# EAGLE design xboard (EAGLE 6.1)
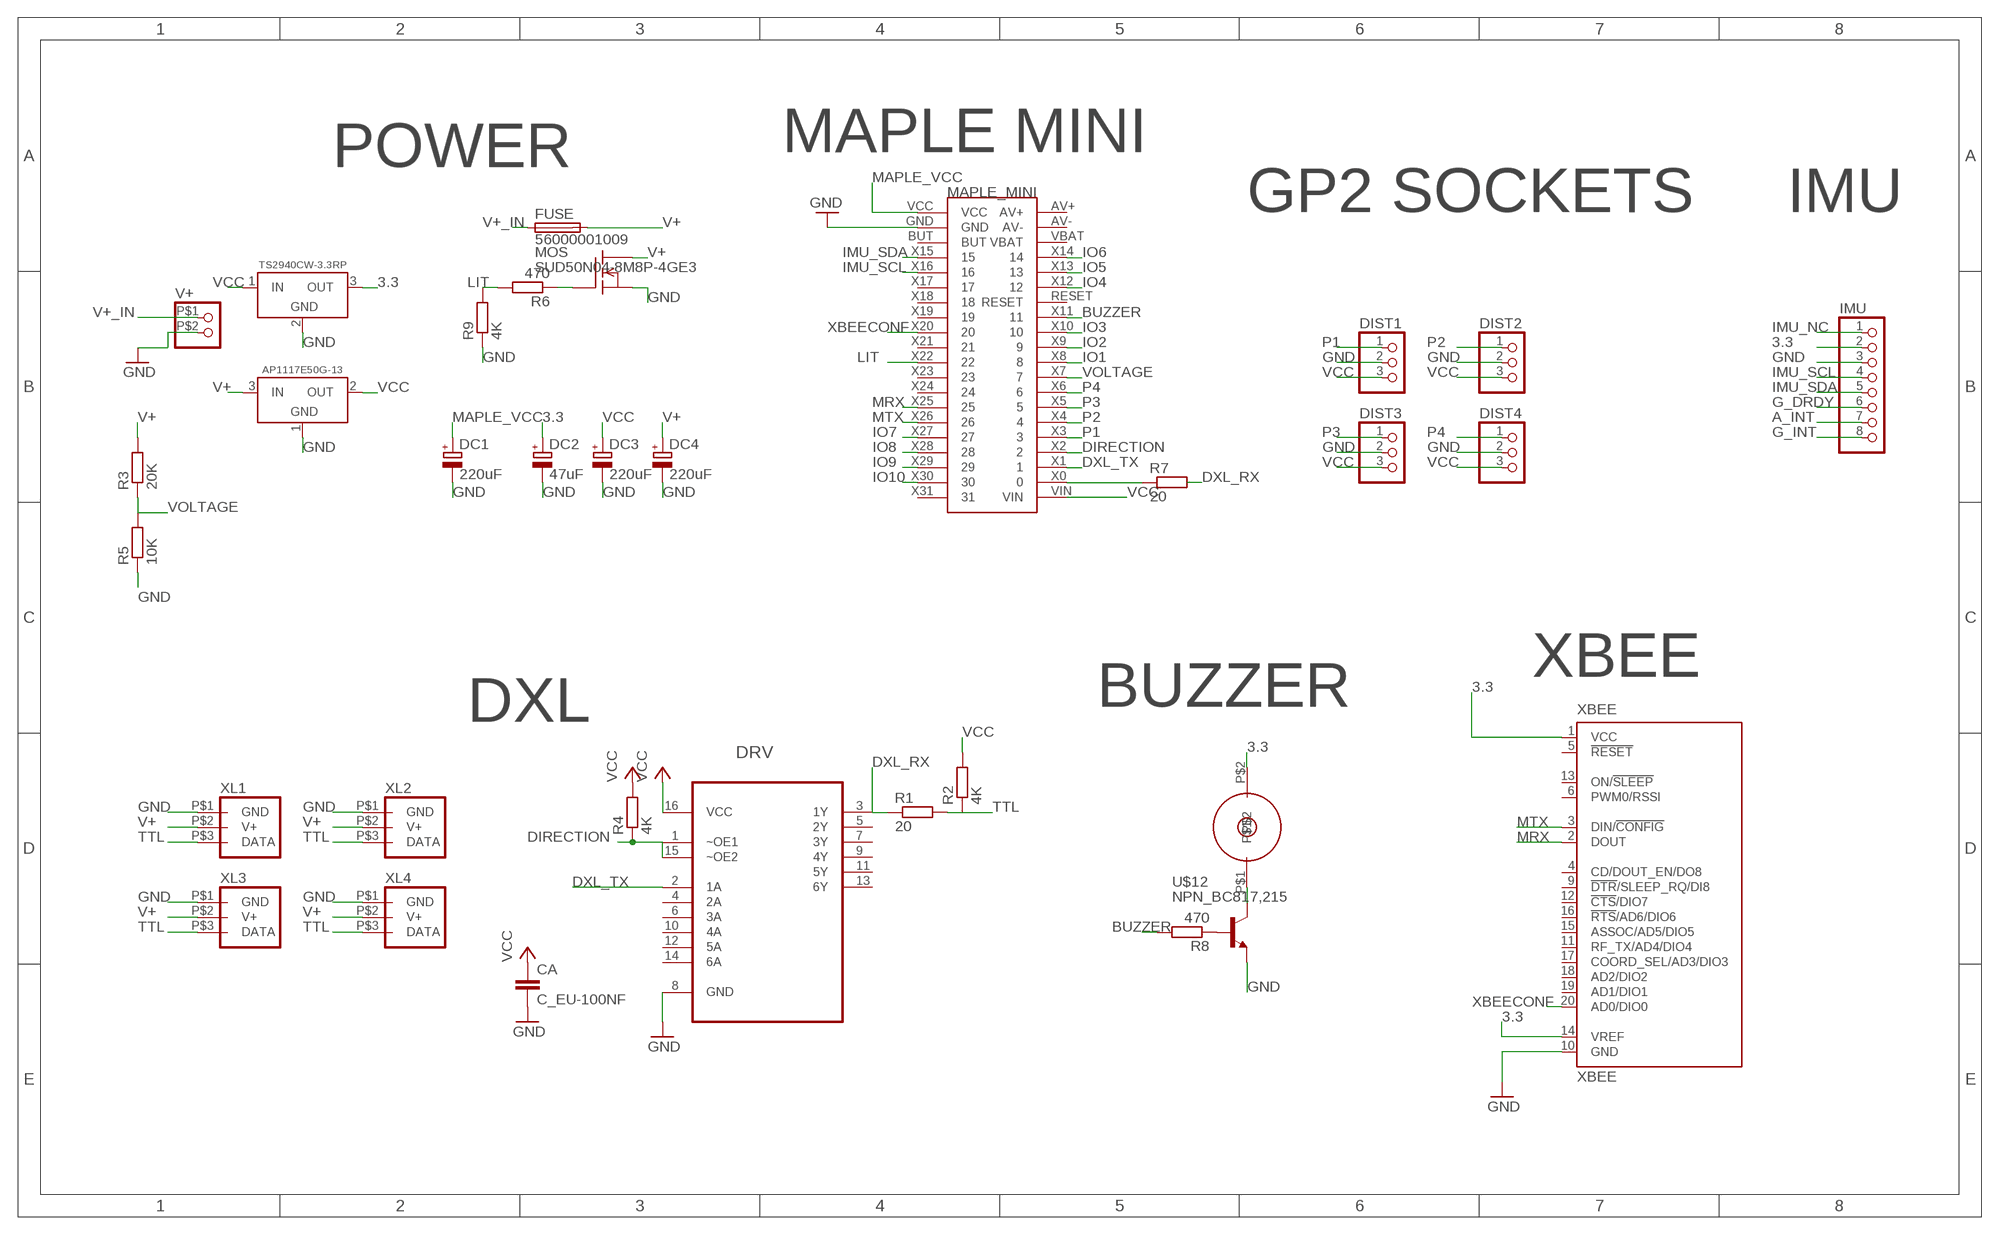
[diagram p0: schematic, sheet 1]

## Parts
BUZZER  BUZZER66  [BUZZER66]
CA  C_EU-100NF  [C0805]
DC1  220uF  CPOL_EUPANASONIC_D8  [PANASONIC_D8]
DC2  47uF  CPOL_EUPANASONIC_D  [PANASONIC_D]
DC3  220uF  CPOL_EUPANASONIC_D8  [PANASONIC_D8]
DC4  220uF  CPOL_EUPANASONIC_D8  [PANASONIC_D8]
DIST1  CONNEC_1X03  [CONNEC_1X03]
DIST2  CONNEC_1X03  [CONNEC_1X03]
DIST3  CONNEC_1X03  [CONNEC_1X03]
DIST4  CONNEC_1X03  [CONNEC_1X03]
DRV  CD74HCT367M  [SOIC127P600X175-16N]
FUSE  56000001009  [56000001009]
IMU  CONNEC_1X08  [CONNEC_1X08]
MAPLE_MINI  MAPLE_MINI  [CONNEC_2X20]
MOS  SUD50N04-8M8P-4GE3  [TO252]
R1  20  R-EU_R0805  [R0805]
R2  4K  R-EU_R0805  [R0805]
R3  20K  R-EU_R0805  [R0805]
R4  4K  RESISTANCE-R0805  [R0805]
R5  10K  R-EU_R0805  [R0805]
R6  470  R-EU_R0805  [R0805]
R7  20  R-EU_R0805  [R0805]
R8  470  R-EU_R0805  [R0805]
R9  4K  RESISTANCE-R0805  [R0805]
U$7  TS2940CW-3.3RP  [SOT223]
U$8  AP1117E50G-13  [SOT223]
U$12  NPN_BC817,215  [SOT-23]
V+  CONNEC_1X02BIG  [CONNEC_1X02_BIG]
XBEE  XBEE  [XBEE]
XL1  XL_320_CONNEC  [DXL_320_CONNEC]
XL2  XL_320_CONNEC  [DXL_320_CONNEC]
XL3  XL_320_CONNEC  [DXL_320_CONNEC]
XL4  XL_320_CONNEC  [DXL_320_CONNEC]

## Nets
3.3: BUZZER.P$2 DC2.+ IMU.2 U$7.3(OUT) XBEE.1(VCC) XBEE.14(VREF)
A_INT: IMU.7
BUZZER: MAPLE_MINI.X11 R8.2
DIRECTION: DRV.1(~OE1) DRV.15(~OE2) MAPLE_MINI.X2 R4.1
DXL_RX: DRV.3(1Y) R1.1 R7.2
DXL_TX: DRV.2(1A) MAPLE_MINI.X1
G_DRDY: IMU.6
G_INT: IMU.8
GND [alime]: CA.2 DC1.- DC2.- DC3.- DC4.- DIST1.2 DIST2.2 DIST3.2 DIST4.2 DRV.8(GND) IMU.3 MAPLE_MINI.GND MOS.2(S) R5.1 R9.1 U$7.2(GND) U$8.1(GND) U$12.2(E) V+.P$2 XBEE.10(GND) XL1.P$1(GND) XL2.P$1(GND) XL3.P$1(GND) XL4.P$1(GND)
IMU_NC: IMU.1
IMU_SCL: IMU.4 MAPLE_MINI.X16
IMU_SDA: IMU.5 MAPLE_MINI.X15
IO1: MAPLE_MINI.X8
IO2: MAPLE_MINI.X9
IO3: MAPLE_MINI.X10
IO4: MAPLE_MINI.X12
IO5: MAPLE_MINI.X13
IO6: MAPLE_MINI.X14
IO7: MAPLE_MINI.X27
IO8: MAPLE_MINI.X28
IO9: MAPLE_MINI.X29
IO10: MAPLE_MINI.X30
LIT: MAPLE_MINI.X22 R6.2 R9.2
MAPLE_VCC: DC1.+ MAPLE_MINI.VCC
MRX: MAPLE_MINI.X25 XBEE.2(DOUT)
MTX: MAPLE_MINI.X26 XBEE.3(DIN/!CONFIG)
N$1: MOS.1(G) R6.1
N$2: MAPLE_MINI.X0 R7.1
N$3: R8.1 U$12.1(B)
N$5: BUZZER.P$1 U$12.3(C)
P1: DIST1.1 MAPLE_MINI.X3
P2: DIST2.1 MAPLE_MINI.X4
P3: DIST3.1 MAPLE_MINI.X5
P4: DIST4.1 MAPLE_MINI.X6
TTL: R1.2 R2.1 XL1.P$3(DATA) XL2.P$3(DATA) XL3.P$3(DATA) XL4.P$3(DATA)
V+ [alime]: DC4.+ FUSE.P$2 MOS.3(D) R3.2 U$8.3(IN) XL1.P$2(V+) XL2.P$2(V+) XL3.P$2(V+) XL4.P$2(V+)
V+_IN [alime]: FUSE.P$1 V+.P$1
VCC: CA.1 DC3.+ DIST1.3 DIST2.3 DIST3.3 DIST4.3 DRV.16(VCC) MAPLE_MINI.VIN R2.2 R4.2 U$7.1(IN) U$8.2(OUT)
VOLTAGE: MAPLE_MINI.X7 R3.1 R5.2
XBEECONF: MAPLE_MINI.X20 XBEE.20(AD0/DIO0)
Unconnected: DRV.4(2A) DRV.5(2Y) DRV.6(3A) DRV.7(3Y) DRV.9(4Y) DRV.10(4A) DRV.11(5Y) DRV.12(5A) DRV.13(6Y) DRV.14(6A) MAPLE_MINI.AV+ MAPLE_MINI.AV- MAPLE_MINI.BUT MAPLE_MINI.RESET MAPLE_MINI.VBAT MAPLE_MINI.X17 MAPLE_MINI.X18 MAPLE_MINI.X19 MAPLE_MINI.X21 MAPLE_MINI.X23 MAPLE_MINI.X24 MAPLE_MINI.X31 XBEE.4(CD/DOUT_EN/DO8) XBEE.5(!RESET) XBEE.6(PWM0/RSSI) XBEE.9(!DTR!/SLEEP_RQ/DI8) XBEE.11(RF_TX/AD4/DIO4) XBEE.12(!CTS!/DIO7) XBEE.13(ON/!SLEEP) XBEE.15(ASSOC/AD5/DIO5) XBEE.16(!RTS!/AD6/DIO6) XBEE.17(COORD_SEL/AD3/DIO3) XBEE.18(AD2/DIO2) XBEE.19(AD1/DIO1)

## Notes on the sheet
- POWER | MAPLE MINI
- GP2 SOCKETS | IMU
- XBEE
- DXL | BUZZER

## Library data of the parts
BUZZER = rhoban:BUZZER
CA = rhoban:C_EU: non polarised condo; DATASHEET: condo100nF.pdf; FARNELL_LINK: http://fr.farnell.com/kemet/c0805c104j5ractu/condensateur-100nf-50v-x7r-0805/dp/1414663RL
DC1-DC4 = rhoban:CPOL_EU: 680 uF 16 V : http://fr.farnell.com/panasonic/eeufr1c681l/condensateur-radial-16v-680uf/dp/1800635 680 uF 25 V : http://fr.farnell.com/panasonic/eeufr1e681l/capacitor-radial-25v-680uf-20/dp/2063069 330 uF 25 V : http://fr.farnell.com/panasonic/eeufr1e331/condensateur-radial-25v-330uf/dp/1800648?Ntt=eeufr1e331
DIST1-DIST4 = rhoban:CONNEC_1X03
DRV = rhoban:CD74HCT367M: High-Speed CMOS Logic Hex Buffer/Line Driver,; MPN: CD74HCT367M; OC_FARNELL: 1739593; OC_NEWARK: 50R5270; PACKAGE: SOIC-16; SUPPLIER: Texas Instruments
FUSE = rhoban:56000001009
IMU = rhoban:CONNEC_1X08
MAPLE_MINI = rhoban:MAPLE_MINI
MOS = rhoban:SUD50N04-8M8P-4GE3
R1-R3 R5-R8 = rcl:R-EU_: RESISTOR, European symbol
R4 R9 = rhoban:RESISTANCE: RESISTOR, European symbol
U$7 = rhoban:TS2940CW-3.3RP
U$8 = rhoban:AP1117E50G-13
U$12 = rhoban:NPN
V+ = RobotCampus:CONNEC_1X02
XBEE = RobotCampus:XBEE: XBee (TM) /XBee-PRO(TM) OEM RF Modules Source: MaxStream, Inc. xbee_productmanual.pdf; MPN: XBP24-Z7UIT-004; OC_FARNELL: 1751799; OC_NEWARK: 34R5507
XL1-XL4 = RobotCampus:XL_320_CONNEC

## Net classes
0 default: width 0.254 mm
1 alime: width 0.889 mm, drill 0.33 mm

## Board
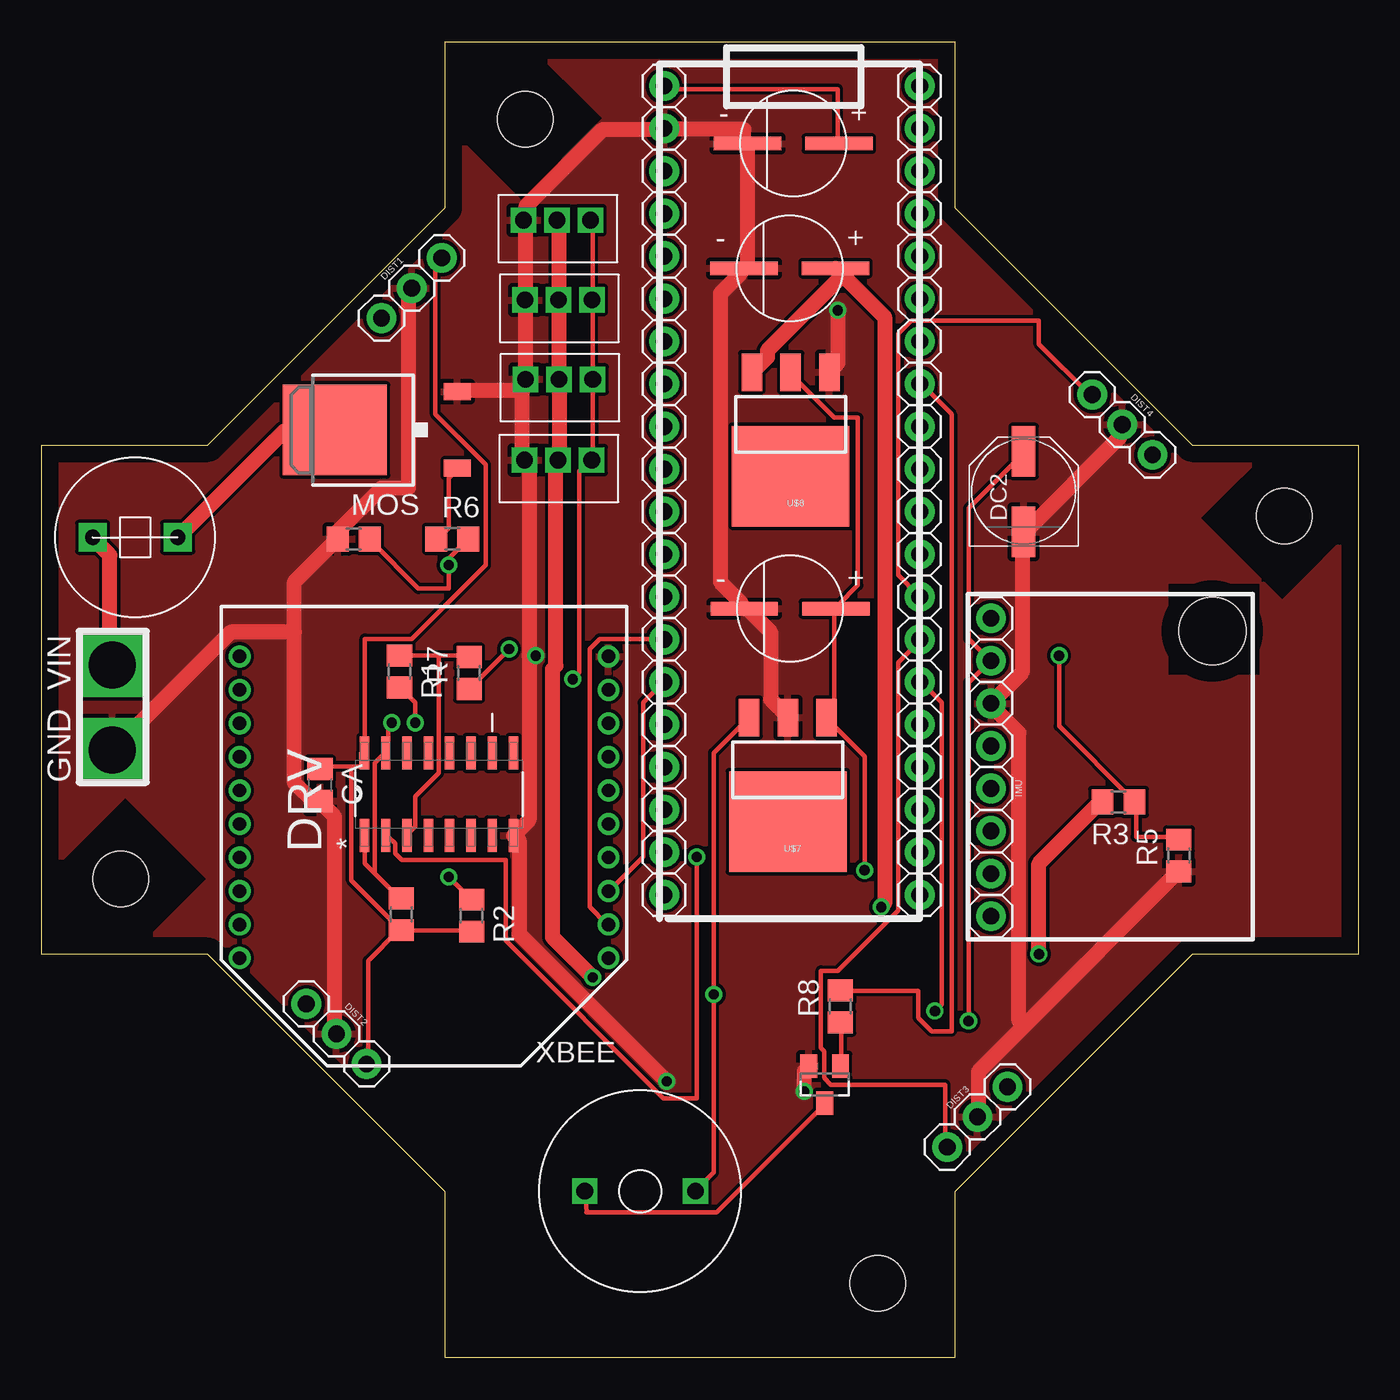
[diagram p1: board, top side]
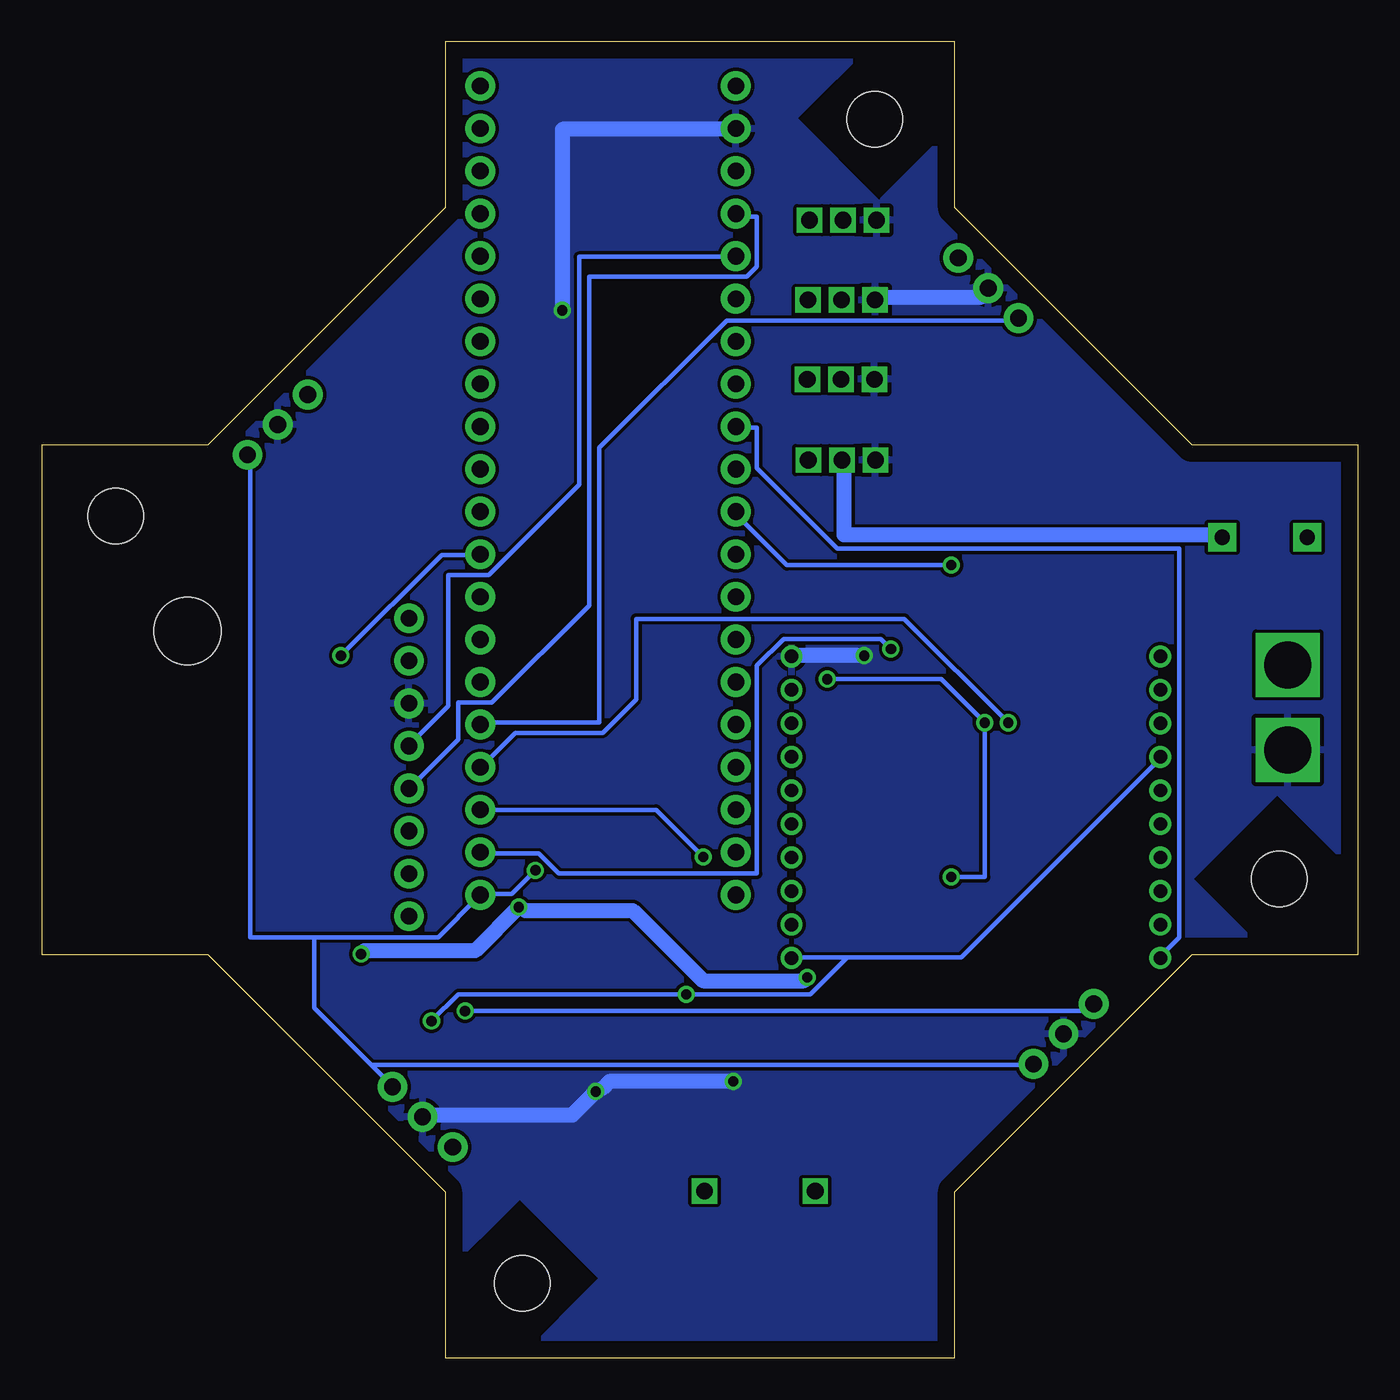
[diagram p2: board, bottom side, seen from below]

Size 78.49 x 78.49 mm. Coordinates in mm from the lower left corner, seen from the top.
Outline: 24.04,68.59 24.04,78.49 54.45,78.49 54.45,68.59 68.59,54.45 78.49,54.45 78.49,24.04 68.59,24.04 54.45,9.9 54.45,0 24.04,0 24.04,9.9 9.9,24.04 0,24.04 0,54.45 9.9,54.45 24.04,68.59
Copper layers (1*16): Top 0.035mm / dielectric 1.5mm / Bottom 0.035mm
Design rules: minimum track width 10mil, minimum drill 24mil, track to track 8mil, track to pad 8mil, pad to pad 8mil, via to via 8mil, smd to smd 8mil, copper to edge 40mil, drill to drill 8mil, minimum pad ring 10mil, minimum via ring 8mil, stop-mask expansion 4mil, vias tented up to drill 0mil, thermal gap 10mil
Holes 4 mm at 69.8,43.35
tRestrict: area 45.3,0.1 to 54.7,9.4; area 0,23.6 to 9.8,33.4; area 69.1,45.3 to 78.8,54.9; area 23.9,69.1 to 33.4,78.6; area 67.2,40.8 to 72.6,46.2
bRestrict: area 45.3,0.1 to 54.7,9.4; area -0.1,23.6 to 9.8,33.5; area 69,45.1 to 79,55.2; area 23.9,69.1 to 33.4,78.6; area 67.2,40.8 to 72.6,46.2
Milling: 16 lines

### Footprints (pad centres in the part's own frame; a part is rotated, then mirrored left to right if it is on the bottom)
BUZZER66 = drill 1 square: P$1 -3.3,0; P$2 3.3,0
C0805 = smd 1.3 x 1.5: 1 -0.95,0; 2 0.95,0
PANASONIC_D8 = smd 4.016 x 0.8: + 2.73,0; - -2.73,0
PANASONIC_D = smd 3 x 1.4: + 2.4,0; - -2.4,0
CONNEC_1X03 = drill 1 pad 1.778: 1 -1.27,1.27; 2 1.27,1.27; 3 3.81,1.27
SOIC127P600X175-16N = smd 1.981 x 0.559: 1 -2.464,4.445; 2 -2.464,3.175; 3 -2.464,1.905; 4 -2.464,0.635; 5 -2.464,-0.635; 6 -2.464,-1.905; 7 -2.464,-3.175; 8 -2.464,-4.445; 9 2.464,-4.445; 10 2.464,-3.175; 11 2.464,-1.905; 12 2.464,-0.635; 13 2.464,0.635; 14 2.464,1.905; 15 2.464,3.175; 16 2.464,4.445
56000001009 = drill 0.9 pad 1.676 square: P$1 -2.54,0; P$2 2.54,0
CONNEC_1X08 = drill 1 pad 1.778: 1 -10.16,0; 2 -7.62,0; 3 -5.08,0; 4 -2.54,0; 5 0,0; 6 2.54,0; 7 5.08,0; 8 7.62,0
CONNEC_2X20 = drill 1 pad 1.778: AV+ 0,0; AV- 2.54,0; BUT 5.08,-15.24; GND 2.54,-15.24; RESET 15.24,0; VBAT 5.08,0; VCC 0,-15.24; VIN 48.26,0; X0 45.72,0; X1 43.18,0; X2 40.64,0; X3 38.1,0; X4 35.56,0; X5 33.02,0; X6 30.48,0; X7 27.94,0; X8 25.4,0; X9 22.86,0; X10 20.32,0; X11 17.78,0; X12 12.7,0; X13 10.16,0; X14 7.62,0; X15 7.62,-15.24; X16 10.16,-15.24; X17 12.7,-15.24; X18 15.24,-15.24; X19 17.78,-15.24; X20 20.32,-15.24; X21 22.86,-15.24; X22 25.4,-15.24; X23 27.94,-15.24; X24 30.48,-15.24; X25 33.02,-15.24; X26 35.56,-15.24; X27 38.1,-15.24; X28 40.64,-15.24; X29 43.18,-15.24; X30 45.72,-15.24; X31 48.26,-15.24
TO252 = smd 1 x 1.6: 1 -2.28,-4.8; 2 2.28,-4.8 | smd 5.4 x 6.2: 3 0,2.5
R0805 = smd 1.3 x 1.5: 1 -0.95,0; 2 0.95,0
STAND-OFF = hole 3.302: 0,0
SOT223 = smd 1.219 x 2.235: 1 -2.311,-3.099; 2 0,-3.099; 3 2.311,-3.099 | smd 7 x 6: 4 0,3.099
SOT-23 = smd 1 x 1.4: 1 -0.95,-1.1; 2 0.95,-1.1; 3 0,1.1
CONNEC_1X02_BIG = drill 2.8 square: P$1 0,0; P$2 5.08,0
XBEE = drill 0.8 pad 1.27: 1 -11,9; 2 -11,7; 3 -11,5; 4 -11,3; 5 -11,1; 6 -11,-1; 7 -11,-3; 8 -11,-5; 9 -11,-7; 10 -11,-9; 11 11,-9; 12 11,-7; 13 11,-5; 14 11,-3; 15 11,-1; 16 11,1; 17 11,3; 18 11,5; 19 11,7; 20 11,9
DXL_320_CONNEC = drill 1 square: P$1 -10,2.5; P$2 -8,2.5; P$3 -6,2.5

### Placement (x,y rotation side)
BUZZER  35.67,9.93 0 top
CA  16.58,34.16 270 top
DC1  44.8,72.43 0 top
DC2  58.54,51.66 90 top
DC3  44.62,44.68 0 top
DC4  44.6,64.98 0 top
DIST1  22.05,62.01 45 top
DIST2  15.77,19.31 315 top
DIST3  55.79,12.56 45 top
DIST4  62.63,55.65 315 top
DRV  23.68,33.61 90 top
FUSE  5.56,48.93 0 top
IMU  56.6,33.95 270 top
MAPLE_MINI  52.34,75.86 270 top
MOS  19.97,55.34 90 top
R1  21.33,40.92 270 top
R2  25.63,26.36 270 top
R3  64.2,33.15 180 top
R4  21.43,26.44 270 top
R5  67.8,29.95 90 top
R6  24.47,48.84 0 top
R7  25.47,40.84 90 top
R8  47.61,20.95 90 top
R9  18.6,48.83 0 top
U$1  [STAND-OFF]  4.69,28.55 45 top
U$2  [STAND-OFF]  49.86,4.44 45 top
U$3  [STAND-OFF]  74.1,50.21 45 top
U$4  [STAND-OFF]  28.81,73.88 45 top
U$7  44.48,35.07 180 top
U$8  44.65,55.68 180 top
U$12  46.68,16.29 180 top
V+  4.18,41.33 270 top
XBEE  22.79,32.83 180 top
XL1  38.84,55.86 0 top
XL2  38.71,65.36 0 top
XL3  38.8,60.59 0 top
XL4  38.78,51.04 0 top

### Tracks (layer width: path | path; a pad name or v marks a point on that pad's centre or on a via)
3.3  (via drill 0.61)
  Top 0.254: U$7.3 42.06,38.07 40.06,36.07 v40.06,21.67 40.06,11.07 40.06,11.05 BUZZER.P$2 | DC2.+ 58.46,53.87 55.26,50.67 55.26,42.87 56.46,41.67 IMU.2 56.46,41.47 55.26,40.27 v55.26,20.07
  Bottom 0.254: 30.46,23.87 33.66,23.87 XBEE.1 | 30.46,23.87 23.66,23.87 11.86,35.67 XBEE.14 | v55.26,20.07 53.66,21.67 v40.06,21.67 32.66,21.67 30.46,23.87
BUZZER
  Top 0.254: R8.2 47.66,21.87 52.26,21.87 52.26,20.27 53.06,19.47 54.26,19.47 54.26,56.27 52.46,58.07 MAPLE_MINI.X11
DIRECTION  (via drill 0.61)
  Top 0.254: 19.86,28.87 19.26,29.47 19.26,31.07 DRV.1 | 19.86,28.87 21.26,27.47 R4.1 | 19.86,28.87 19.86,35.47 20.46,36.07 DRV.15 20.66,36.27 20.66,37.67 v20.86,37.87
  Bottom 0.254: v20.86,37.87 27.06,44.07 43.06,44.07 43.06,39.27 45.06,37.27 50.26,37.27 52.26,35.27 MAPLE_MINI.X2
DXL_RX
  Top 0.254: 23.66,41.87 21.46,41.87 R1.1 | 23.66,41.87 25.46,41.87 R7.2 | 23.66,41.87 23.66,34.87 22.26,33.47 22.26,31.67 21.86,31.27 DRV.3
DXL_TX  (via drill 0.61)
  Top 0.254: v39.06,29.87 39.06,15.47 37.06,15.47 27.66,24.87 27.66,29.67 21.46,29.67 21.06,30.07 21.06,30.67 20.66,31.07 DRV.2
  Bottom 0.254: v39.06,29.87 41.86,32.67 52.26,32.67 MAPLE_MINI.X1
GND  (via drill 0.61)
  Top 0.889: DIST4.2 64.26,55.47 64.26,54.87 58.66,49.27 DC2.- 58.46,48.87 58.46,40.87 56.66,39.07 IMU.3 56.86,38.67 58.26,37.27 58.26,20.07 58.56,19.77 | v45.46,15.87 45.46,17.07 45.66,17.27 U$12.2 | 58.56,19.77 55.86,17.07 55.86,14.47 DIST3.2 | 58.56,19.77 67.66,28.87 R5.1 | DIST2.2 17.46,19.47 17.46,32.27 16.66,33.07 CA.2 16.26,33.07 15.06,34.27 15.06,43.27 | 15.06,43.27 15.06,46.27 17.46,48.67 R9.1 17.66,49.27 20.26,51.87 21.86,51.87 21.86,63.67 DIST1.2 | 15.06,43.27 11.26,43.27 4.26,36.27 V+.P$2 | v47.46,62.47 47.46,59.27 47.06,58.87 U$8.1 | U$7.2 44.46,38.27 43.46,39.27 43.46,43.27 42.06,44.67 DC3.- 41.66,45.07 40.46,46.27 40.46,63.47 41.66,64.67 DC4.- 42.06,65.07 42.06,72.27 DC1.- 41.86,72.67 41.86,73.27 37.26,73.27 MAPLE_MINI.GND 36.66,73.27 33.46,73.27 28.86,68.67 28.86,68.27 XL2.P$1 28.86,67.67 28.86,63.47 XL3.P$1 28.86,63.07 28.86,58.67 XL1.P$1 28.66,58.27 28.66,57.67 | 28.66,57.67 24.86,57.67 MOS.2 | 28.26,31.27 29.06,32.07 29.06,41.87 | 29.06,41.87 29.06,53.27 28.86,53.47 XL4.P$1 28.66,53.87 28.66,57.67 | 28.26,31.27 DRV.8 | v29.46,41.87 29.06,41.87 | v37.26,16.47 28.46,25.27 28.46,30.87 28.26,31.27
  Bottom 0.889: DIST3.2 55.66,14.47 46.86,14.47 v45.46,15.87 45.06,16.07 44.66,16.47 v37.26,16.47 | v47.46,62.47 47.46,73.27 37.26,73.27 MAPLE_MINI.GND | DIST1.2 22.06,63.67 22.46,63.27 28.66,63.27 XL3.P$1 | v29.46,41.87 33.66,41.87 XBEE.10
  pour Top: 2.62,95.61 95.15,95.61 95.15,-14.02 -10.08,-14.02 -10.08,53.77
  pour Bottom: -10.8,85.99 88.2,85.99 88.2,-4.4 -24.23,-4.4 -24.23,53.05
IMU_SCL
  Bottom 0.254: IMU.4 56.46,36.67 54.26,38.87 54.26,46.67 51.86,46.67 46.46,52.07 46.46,65.67 37.26,65.67 MAPLE_MINI.X16
IMU_SDA
  Bottom 0.254: IMU.5 56.46,34.07 53.66,36.87 53.66,39.07 51.66,39.07 45.86,44.87 45.86,64.47 36.46,64.47 35.86,65.07 35.86,68.07 37.06,68.07 MAPLE_MINI.X15
LIT  (via drill 0.61)
  Top 0.254: R9.2 19.66,48.67 22.46,45.87 24.26,45.87 v24.26,47.27 24.26,47.67 25.26,48.67 R6.2
  Bottom 0.254: v24.26,47.27 34.06,47.27 37.06,50.27 MAPLE_MINI.X22
MAPLE_VCC
  Top 0.254: MAPLE_MINI.VCC 37.26,75.67 47.46,75.67 47.46,72.47 DC1.+
MRX
  Top 0.254: XBEE.2 33.66,25.87 32.66,26.87 32.66,42.27 33.26,42.87 37.06,42.87 MAPLE_MINI.X25
MTX
  Top 0.254: XBEE.3 33.86,27.87 35.86,29.87 35.86,39.07 37.06,40.27 MAPLE_MINI.X26
N$1
  Top 0.254: R6.1 23.66,48.87 24.26,49.47 24.26,52.47 24.66,52.87 MOS.1
N$2  (via drill 0.61)
  Top 0.254: v27.86,42.27 25.66,40.07 R7.1
  Bottom 0.254: v27.86,42.27 28.46,42.87 34.26,42.87 35.86,41.27 35.86,28.87 47.66,28.87 48.86,30.07 52.26,30.07 MAPLE_MINI.X0
N$3
  Top 0.254: U$12.1 47.66,17.47 47.66,19.87 R8.1
N$5
  Top 0.254: U$12.3 46.66,15.07 40.26,8.67 32.46,8.67 32.49,8.68 BUZZER.P$1
P1
  Bottom 0.254: DIST1.1 20.26,61.87 37.66,61.87 45.26,54.27 45.26,37.87 52.26,37.87 MAPLE_MINI.X3
P2  (via drill 0.61)
  Top 0.254: v53.26,20.67 53.66,21.07 53.66,39.07 52.46,40.27 MAPLE_MINI.X4
  Bottom 0.254: v53.26,20.67 16.26,20.67 15.86,21.07 DIST2.1
P3
  Top 0.254: MAPLE_MINI.X5 52.26,42.67 51.06,41.47 51.06,26.67 47.46,23.07 46.46,23.07 46.46,18.47 46.66,18.27 46.66,16.67 47.06,16.27 53.86,16.27 53.86,12.67 DIST3.1
P4
  Top 0.254: MAPLE_MINI.X6 52.26,45.47 51.06,46.67 51.06,61.07 51.86,61.87 59.46,61.87 59.46,60.47 62.46,57.47 DIST4.1
TTL  (via drill 0.61)
  Top 0.254: v22.26,37.87 22.26,39.07 21.46,39.87 R1.2 | v24.26,28.67 25.46,27.47 R2.1 | XL2.P$3 32.86,67.67 32.86,63.27 XL3.P$3 32.86,63.07 32.86,58.47 XL1.P$3 32.86,58.27 32.86,53.67 XL4.P$3 32.66,53.47 32.06,52.87 32.06,40.87 v31.66,40.47
  Bottom 0.254: v24.26,28.67 22.26,28.67 v22.26,37.87 24.86,40.47 v31.66,40.47
V+  (via drill 0.61)
  Top 0.889: XL2.P$2 30.86,67.67 30.86,63.47 XL3.P$2 30.86,63.07 30.86,58.67 XL1.P$2 30.86,58.27 30.86,53.67 XL4.P$2 30.66,53.27 30.66,41.27 30.46,41.07 30.46,25.07 v32.86,22.67 | FUSE.P$2 8.26,49.07 14.46,55.27 17.46,55.27 MOS.3 | v59.46,24.07 59.46,29.47 63.06,33.07 R3.2 | v50.06,26.87 50.26,27.07 50.26,62.07 47.76,64.57 | 47.76,64.57 47.46,64.87 DC4.+ | 47.76,64.57 43.26,60.07 43.26,59.67 42.46,58.87 U$8.3
  Bottom 0.889: XL4.P$2 30.66,53.47 30.66,49.07 8.26,49.07 FUSE.P$2 | v59.46,24.07 59.26,24.27 52.66,24.27 v50.06,26.87 49.66,26.67 43.26,26.67 39.06,22.47 33.06,22.47 v32.86,22.67
V+_IN
  Top 0.889: FUSE.P$1 3.06,48.87 4.06,47.87 4.06,41.47 V+.P$1
VCC  (via drill 0.61)
  Top 0.254: 18.46,35.27 19.06,35.27 19.06,36.07 DRV.16 19.26,36.27 19.26,42.87 22.06,42.87 26.46,47.27 26.46,53.27 23.46,56.27 23.46,65.27 23.66,65.47 DIST1.3 | 18.46,35.27 16.66,35.27 CA.1 | R2.2 25.46,25.47 21.46,25.47 R4.2 | R4.2 21.26,25.47 19.46,23.67 19.46,17.67 DIST2.3 | 18.46,35.27 18.46,28.47 21.26,25.67 R4.2 | U$8.2 44.66,58.67 47.26,56.07 48.66,56.07 48.66,46.07 47.46,44.87 DC3.+ 47.26,44.67 47.26,38.67 46.86,38.27 U$7.1 46.86,38.07 49.06,35.87 v49.06,29.07
  Bottom 0.254: 58.86,17.47 62.26,20.87 62.26,25.07 | 58.86,17.47 57.66,16.27 DIST3.3 | 62.26,25.07 54.86,25.07 52.46,27.47 MAPLE_MINI.VIN 52.26,27.67 50.46,27.67 v49.06,29.07 | 62.26,25.07 66.06,25.07 66.06,53.67 DIST4.3 | 58.86,17.47 19.46,17.47 DIST2.3
VOLTAGE  (via drill 0.61)
  Top 0.254: R5.2 67.66,31.07 65.26,31.07 65.26,33.07 R3.1 65.06,33.27 60.66,37.67 v60.66,41.87
  Bottom 0.254: v60.66,41.87 54.66,47.87 52.46,47.87 MAPLE_MINI.X7
XBEECONF
  Bottom 0.254: XBEE.20 11.86,23.87 10.66,25.07 10.66,48.27 31.06,48.27 35.86,53.07 35.86,55.47 37.06,55.47 MAPLE_MINI.X20

### Text on the board
tPlace: VIN | GND